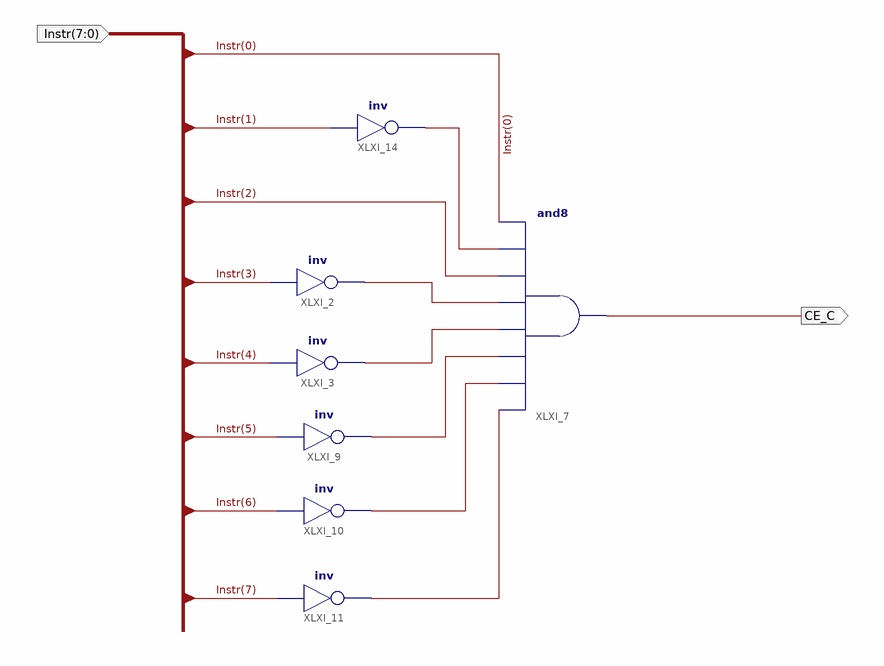
[diagram p0: schematic sheet 1]
// Xilinx ISE schematic instrLDC.sch (spartan3e) as structural Verilog: 7 symbols, 2 ports
module instrLDC (
  input  [7:0] Instr,
  output CE_C
);

  wire XLXN_3, XLXN_4, XLXN_5, XLXN_6, XLXN_10, XLXN_11;

  not XLXI_2 (XLXN_3, Instr[3]);
  not XLXI_3 (XLXN_4, Instr[4]);
  not XLXI_9 (XLXN_5, Instr[5]);
  not XLXI_10 (XLXN_6, Instr[6]);
  not XLXI_11 (XLXN_10, Instr[7]);
  and XLXI_7 (CE_C, XLXN_10, XLXN_6, XLXN_5, XLXN_4, XLXN_3, Instr[2], XLXN_11, Instr[0]);
  not XLXI_14 (XLXN_11, Instr[1]);
endmodule
